# EAGLE design tetrafol (EAGLE 5.06)
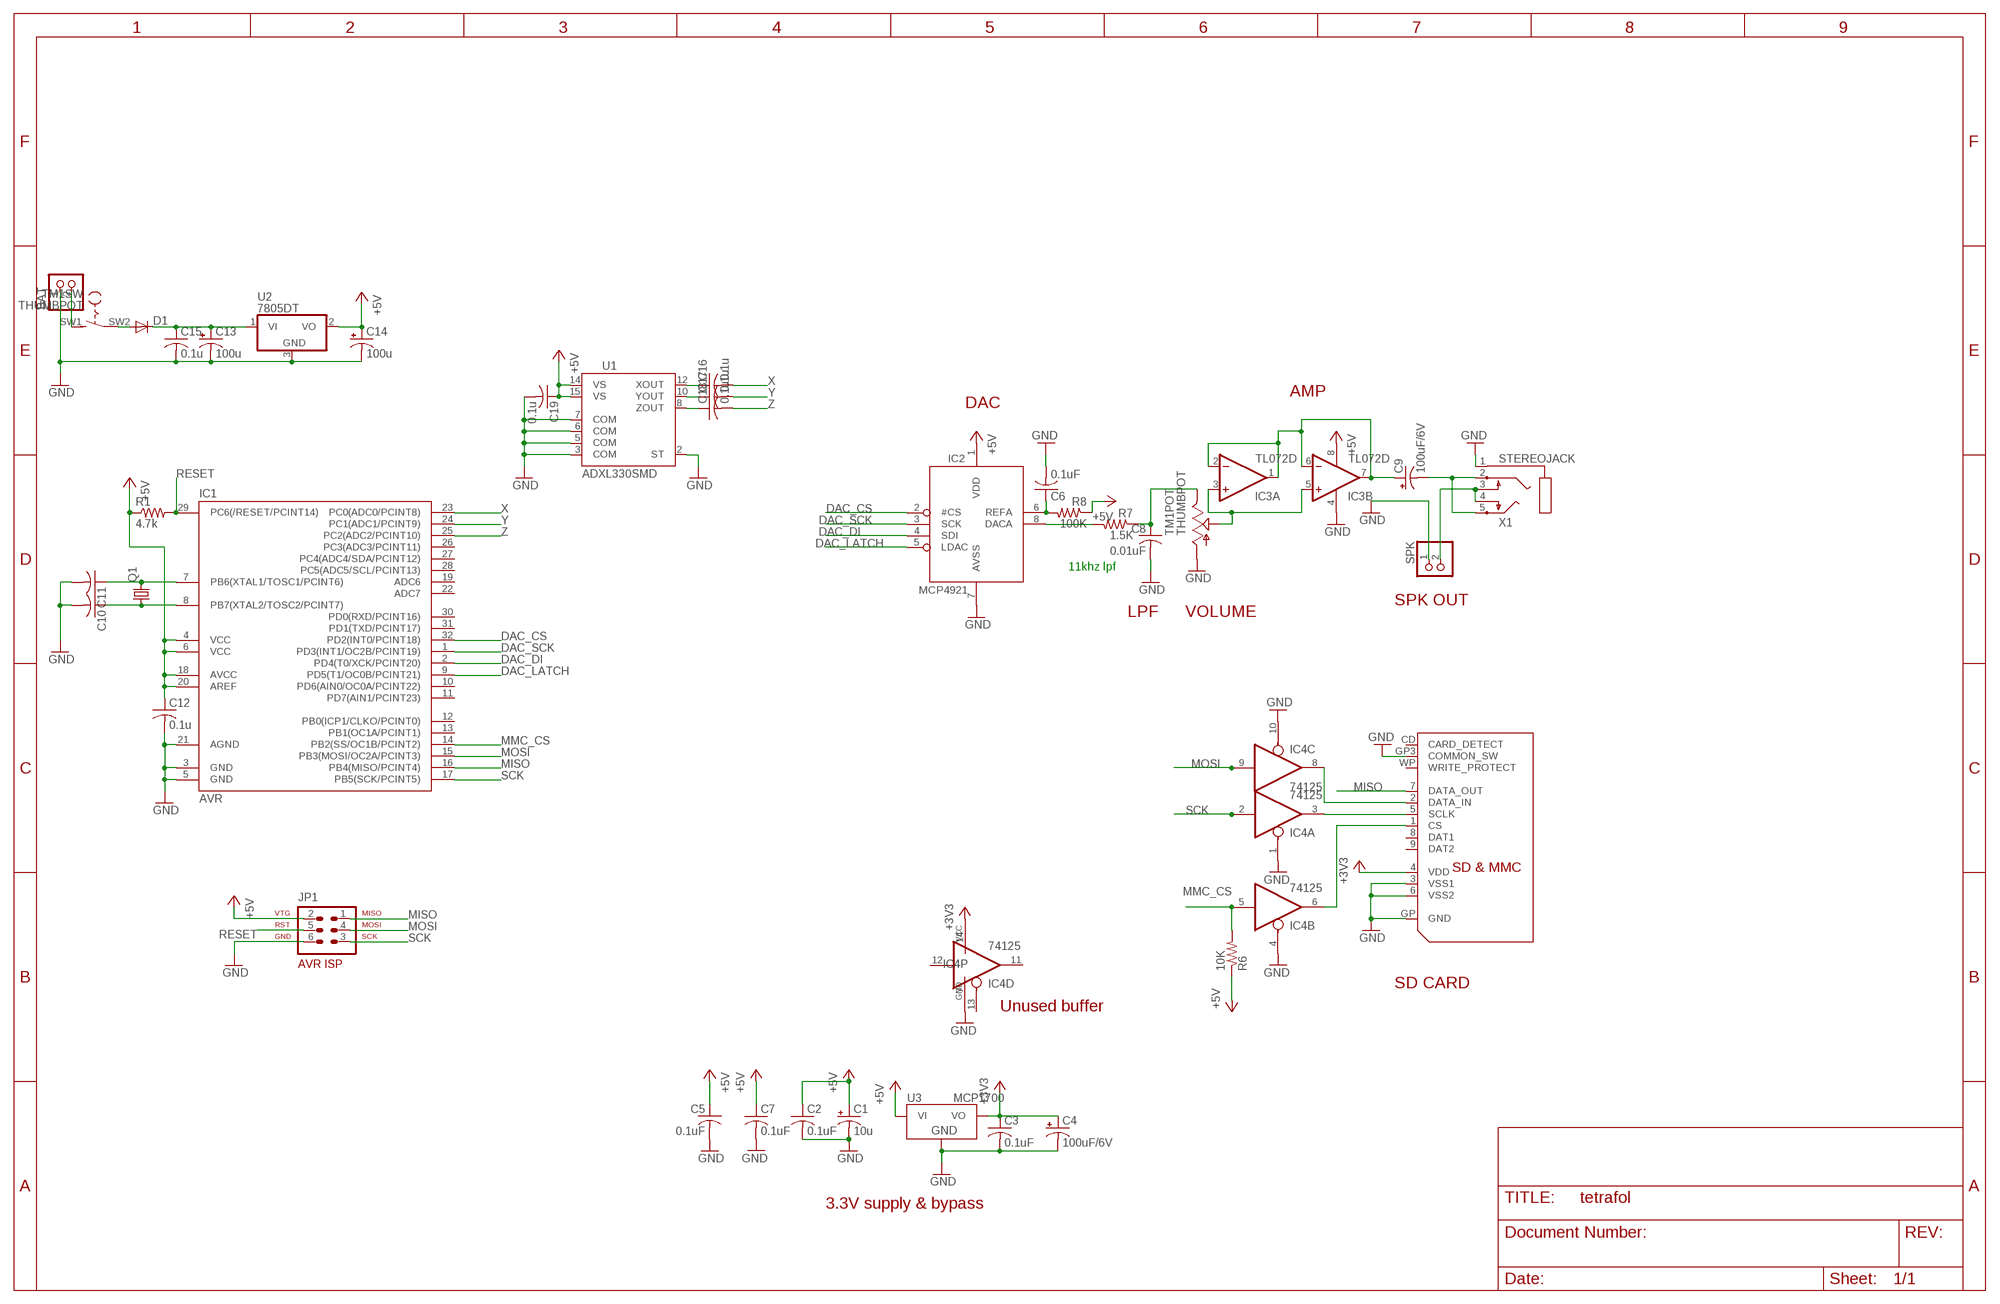
[diagram p0: schematic, sheet 1]

## Parts
BAT  PINHD-1X2  [1X02]
C1  10u  CPOL-USB  [PANASONIC_B]
C2  0.1uF  C-USC1206  [C1206]
C3  0.1uF  C-USC1206  [C1206]
C4  100uF/6V  CPOL-USC  [PANASONIC_C]
C5  0.1uF  C-USC1206  [C1206]
C6  0.1uF  C-USC1206  [C1206]
C7  0.1uF  C-USC1206  [C1206]
C8  0.01uF  C-USC1206  [C1206]
C9  100uF/6V  CPOL-USB  [PANASONIC_B]
C10  C-USC1206  [C1206]
C11  C-USC1206  [C1206]
C12  0.1u  C-USC1206  [C1206]
C13  100u  CPOL-USC  [PANASONIC_C]
C14  100u  CPOL-USC  [PANASONIC_C]
C15  0.1u  C-USC1206  [C1206]
C16  0.1u  C-USC1206  [C1206]
C17  0.1u  C-USC1206  [C1206]
C18  0.1u  C-USC1206  [C1206]
C19  0.1u  C-USC1206  [C1206]
D1  DIODESMA  [SMA-DIODE]
IC1  AVR  MEGA48/88/168-AU  [TQFP32-08]
IC2  MCP4921  [SO08]
IC3  TL072D  [SO08]
IC4  74125  [SO14]
JP1  isp  AVR-ISP-6  [AVR-ISP-6]
Q1  CRYSTALHC49UP  [HC49UP]
R1  4.7k  R-US_R1206  [R1206]
R6  10K  R-US_R1206  [R1206]
R7  1.5K  R-US_R1206  [R1206]
R8  100K  R-US_R1206  [R1206]
SPK  PINHD-1X2  [1X02]
TM1  THUMBPOT  [THUMBWHEEL]
U1  ADXL330SMD  [LFCSP-16]
U2  7805DT  [TO252]
U3  MCP1700  [SOT23]
U$2  SDMMC06132  [06132]
X1  STEREOJACK  [STX3100]

## Nets
+3V3: C3.1 C4.+ IC4.14(P:VCC) U3.2(VO) U$2.4(VDD)
+5V: C1.+ C2.1 C5.1 C7.1 C12.1 C14.+ C19.1 IC1.4(VCC) IC1.6(VCC) IC1.18(AVCC) IC1.20(AREF) IC2.1(VDD) IC3.8(P:V+) JP1.2 R1.1 R6.1 R8.1 U1.14(VS) U1.15(VS) U2.2(VO) U3.3(VI)
DAC_CS: IC1.32(PD2(INT0/PCINT18)) IC2.2(#CS)
DAC_DI: IC1.2(PD4(T0/XCK/PCINT20)) IC2.4(SDI)
DAC_LATCH: IC1.9(PD5(T1/OC0B/PCINT21)) IC2.5(LDAC)
DAC_SCK: IC1.1(PD3(INT1/OC2B/PCINT19)) IC2.3(SCK)
GND: BAT.1 C1.- C2.2 C3.2 C4.- C5.2 C6.2 C7.2 C8.2 C10.2 C11.2 C12.2 C13.- C14.- C15.2 C19.2 IC1.3(GND) IC1.5(GND) IC1.21(AGND) IC2.7(AVSS) IC3.4(P:V-) IC4.1(A:OE) IC4.4(B:OE) IC4.7(P:GND) IC4.10(C:OE) JP1.6 SPK.1 TM1.1(POT:A) U1.2(ST) U1.3(COM) U1.5(COM) U1.6(COM) U1.7(COM) U2.3(GND) U3.1(GND) U$2.3(VSS1) U$2.6(VSS2) U$2.GP3(COMMON_SW) U$2.GP(GND) X1.1
MISO: IC1.16(PB4(MISO/PCINT4)) JP1.1 U$2.7(DATA_OUT)
MMC_CS: IC1.14(PB2(SS/OC1B/PCINT2)) IC4.5(B:I) R6.2
MOSI: IC1.15(PB3(MOSI/OC2A/PCINT3)) IC4.9(C:I) JP1.4
N$1: IC3.3(A:+IN) IC3.5(B:+IN) TM1.2(POT:S)
N$2: C9.- X1.2 X1.5
N$3: C9.+ IC3.1(A:OUT) IC3.2(A:-IN) IC3.6(B:-IN) IC3.7(B:OUT)
N$4: IC2.8(DACA) R7.2
N$5: SPK.2 X1.3 X1.4
N$6: D1.A TM1.SW2(SW:P)
N$10: IC4.6(B:O) U$2.1(CS)
N$11: IC4.8(C:O) U$2.2(DATA_IN)
N$12: IC4.3(A:O) U$2.5(SCLK)
N$14: C16.1 U1.12(XOUT)
N$15: C17.1 U1.10(YOUT)
N$16: C18.1 U1.8(ZOUT)
N$19: C6.1 IC2.6(REFA) R8.2
N$21: C8.1 R7.1 TM1.3(POT:E)
N$23: C11.1 IC1.7(PB6(XTAL1/TOSC1/PCINT6)) Q1.2
N$24: C10.1 IC1.8(PB7(XTAL2/TOSC2/PCINT7)) Q1.1
N$26: C13.+ C15.1 D1.C U2.1(VI)
N$29: BAT.2 TM1.SW1(SW:S)
RESET: IC1.29(PC6(/RESET/PCINT14)) JP1.5 R1.2
SCK: IC1.17(PB5(SCK/PCINT5)) IC4.2(A:I) JP1.3
X: C16.2 IC1.23(PC0(ADC0/PCINT8))
Y: C17.2 IC1.24(PC1(ADC1/PCINT9))
Z: C18.2 IC1.25(PC2(ADC2/PCINT10))
Unconnected: IC1.10(PD6(AIN0/OC0A/PCINT22)) IC1.11(PD7(AIN1/PCINT23)) IC1.12(PB0(ICP1/CLKO/PCINT0)) IC1.13(PB1(OC1A/PCINT1)) IC1.19(ADC6) IC1.22(ADC7) IC1.26(PC3(ADC3/PCINT11)) IC1.27(PC4(ADC4/SDA/PCINT12)) IC1.28(PC5(ADC5/SCL/PCINT13)) IC1.30(PD0(RXD/PCINT16)) IC1.31(PD1(TXD/PCINT17)) IC4.11(D:O) IC4.12(D:I) IC4.13(D:OE) U$2.8(DAT1) U$2.9(DAT2) U$2.CD(CARD_DETECT) U$2.WP(WRITE_PROTECT)

## Notes on the sheet
- AMP
- DAC
- 11khz lpf
- SPK OUT
- LPF | VOLUME
- SD CARD
- Unused buffer
- 3.3V supply & bypass

## Library data of the parts
BAT SPK = pinhead:PINHD-1X2: PIN HEADER
C1 C4 C9 = adafruit:CPOL-US: POLARIZED CAPACITOR, American symbol
C2 C3 C5-C8 = adafruit:C-US: CAPACITOR, American symbol
C10-C12 C15-C19 = rcl:C-US: CAPACITOR, American symbol
C13 C14 = rcl:CPOL-US: POLARIZED CAPACITOR, American symbol
D1 = SparkFun:DIODE: Diode These are standard reverse protection diodes and small signal diodes. SMA package can handle up to about 1A. SOD-323 can handle about 200mA. What the SOD-323 package when ordering, there are some mfgs out there that are 5-pin packages.
IC1 = avr-5:MEGA48/88/168
IC2 = adafruit:MCP4921
IC3 = linear:TL072: OP AMP
IC4 = adafruit:74*125: Quad bus BUFFER, 3-state
JP1 = avr-5:AVR-ISP-6: AVR ISP-6 Serial Programming Header
Q1 = crystal:CRYSTAL: CRYSTAL
R1 = rcl:R-US_: RESISTOR, American symbol
R6-R8 = adafruit:R-US_: RESISTOR, American symbol
TM1 = adafruit:THUMBPOT: Thumbwheel pot with switch Available in horizontal (Alpha RV121SF) or vertical (Xicon 311-1701)
U1 = SparkFun:ADXL330: Triple Axis Accelerometer Analog Devices ADXL330 +/-3g 2.4V-5.25V Analog output. Spark Fun Electronics SKU : COM-00730. Center pad paste layer has been reduced to avoid shorting.
U2 = linear:78*: Positive VOLTAGE REGULATOR Source: http://cache.national.com/ds/LM/LM78L05.pdf http://www.fairchildsemi.com/ds/LM/LM7805.pdf
U3 = SparkFun:MCP1700
U$2 = adafruit:SDMMC: SD MMC Card holder 4UCON part #06132 - easy to solder
X1 = adafruit:STEREOJACK: MIC/HEADPHONE JACK Stereo jack with two switches. Kycon STX3100, CUI SJ1-3555NG and/or 4UCon 05544

## Board
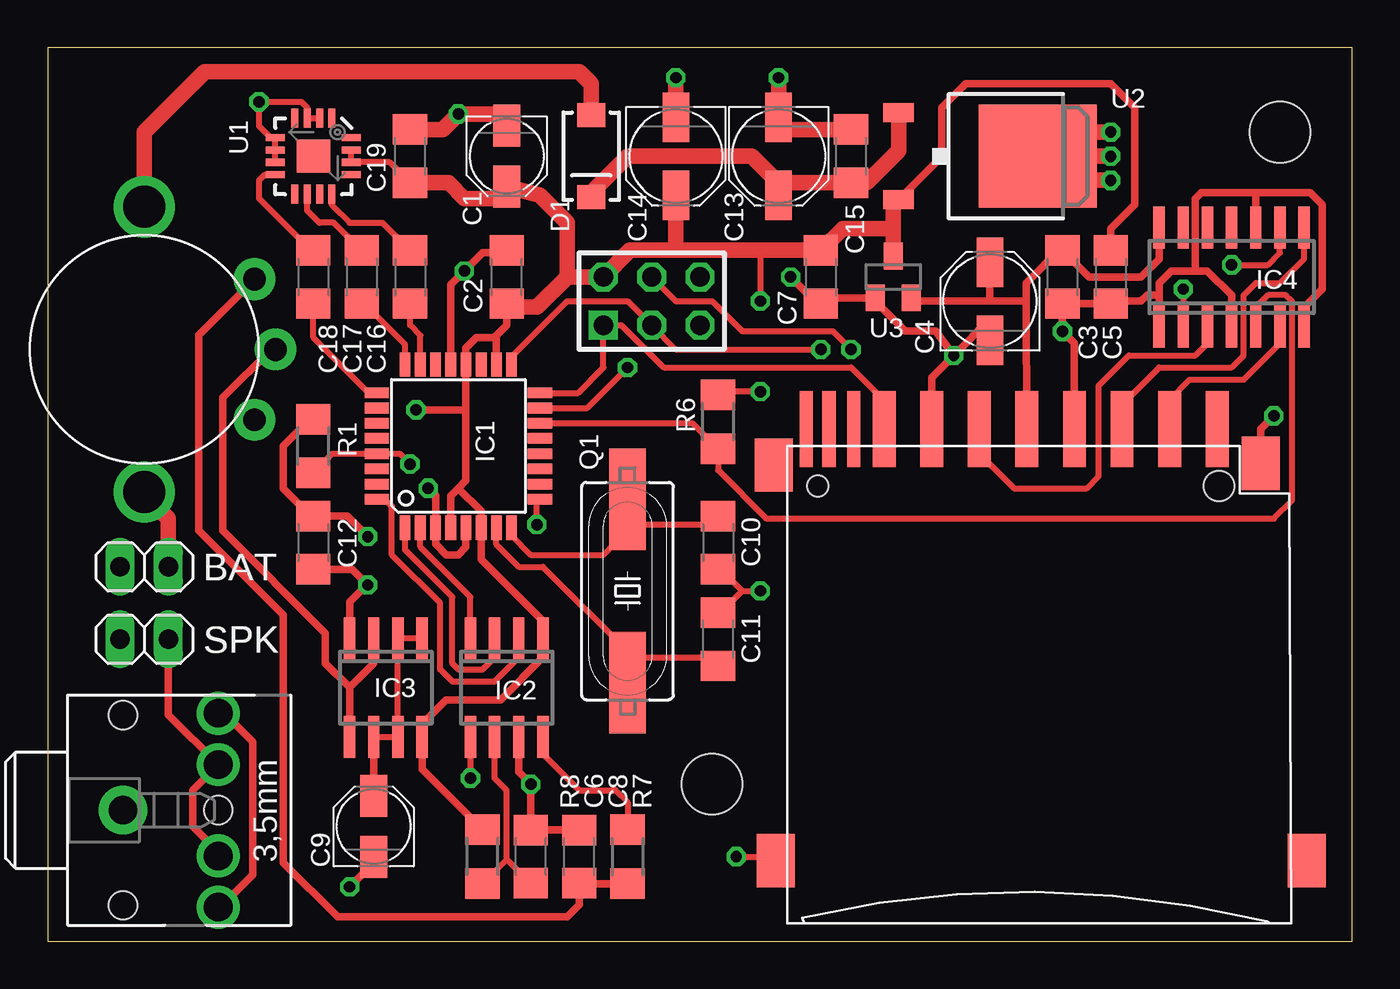
[diagram p1: board, top side]
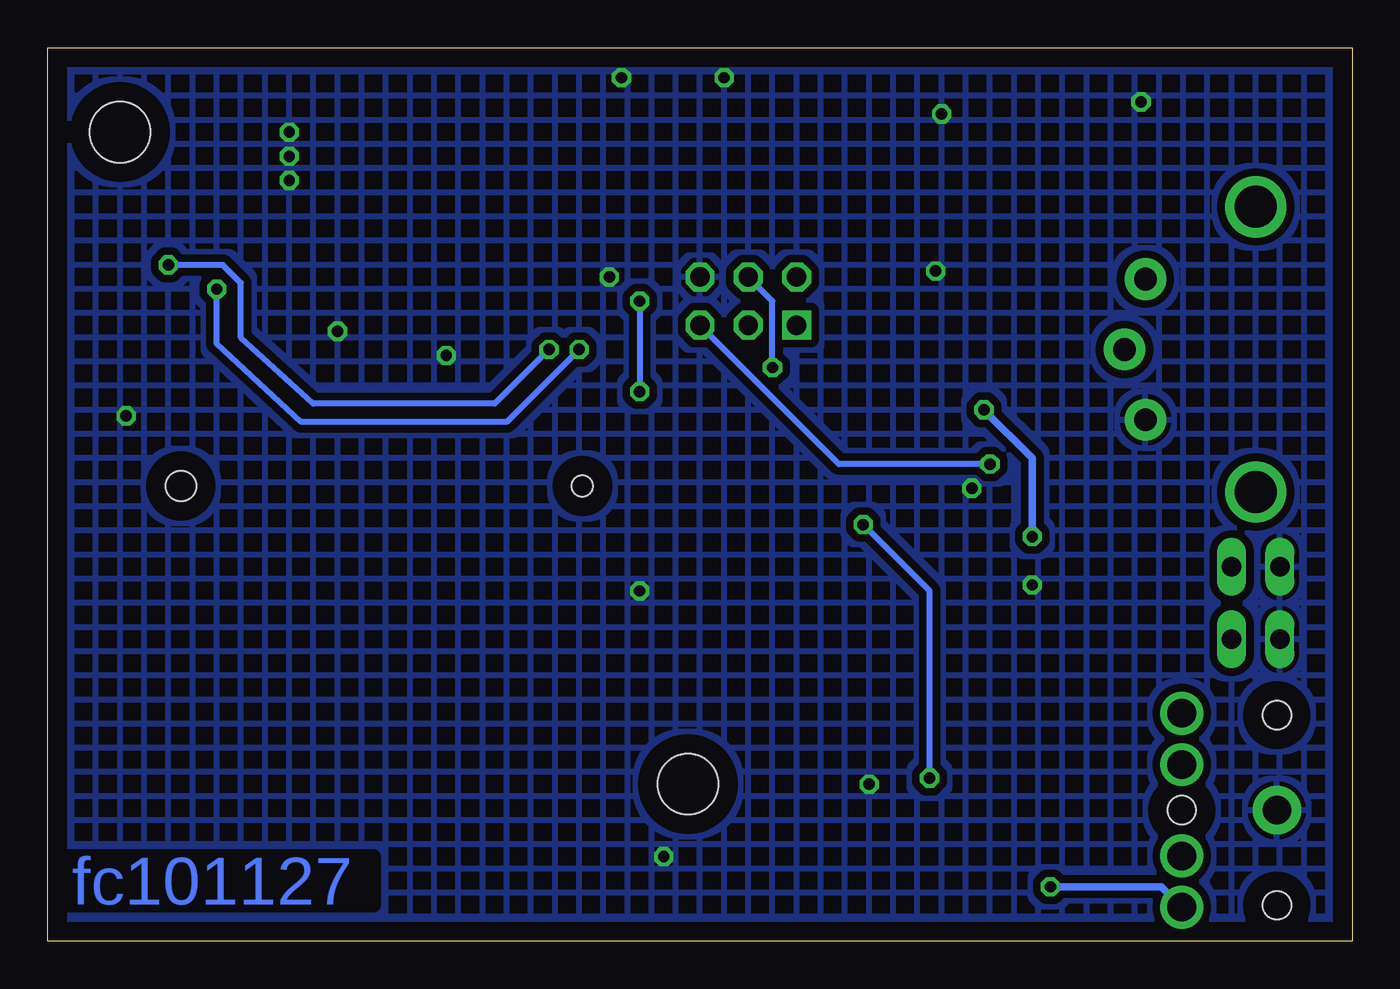
[diagram p2: board, bottom side, seen from below]

Size 68.58 x 46.99 mm. Coordinates in mm from the lower left corner, seen from the top.
Outline: 0,0 68.58,0 68.58,46.99 0,46.98 0,0
Copper layers (1*16): Top 0.035mm / dielectric 1.5mm / Bottom 0.035mm
Design rules "default": minimum track width 10mil, minimum drill 24mil, track to track 8mil, track to pad 8mil, pad to pad 8mil, via to via 8mil, smd to smd 8mil, copper to edge 40mil, drill to drill 8mil, minimum pad ring 10mil, minimum via ring 8mil, stop-mask expansion 4mil, vias tented up to drill 0mil, thermal gap 10mil
Holes 3.2 mm at 34.92,8.26 64.77,42.55

### Footprints (pad centres in the part's own frame; a part is rotated, then mirrored left to right if it is on the bottom)
1X02 = drill 1.016 long: 1 -1.27,0; 2 1.27,0
PANASONIC_B = smd 2.2 x 1.4: + 1.6,0; - -1.6,0
C1206 = smd 1.6 x 1.8: 1 -1.4,0; 2 1.4,0
PANASONIC_C = smd 2.6 x 1.4: + 2.05,0; - -2.05,0
SMA-DIODE = smd 1.27 x 1.47: A -2.15,0; C 2.15,0
TQFP32-08 = smd 1.27 x 0.559: 1 -4.293,2.8; 2 -4.293,2; 3 -4.293,1.2; 4 -4.293,0.4; 5 -4.293,-0.4; 6 -4.293,-1.2; 7 -4.293,-2; 8 -4.293,-2.8; 17 4.293,-2.8; 18 4.293,-2; 19 4.293,-1.2; 20 4.293,-0.4; 21 4.293,0.4; 22 4.293,1.2; 23 4.293,2; 24 4.293,2.8 | smd 0.559 x 1.27: 9 -2.8,-4.293; 10 -2,-4.293; 11 -1.2,-4.293; 12 -0.4,-4.293; 13 0.4,-4.293; 14 1.2,-4.293; 15 2,-4.293; 16 2.8,-4.293; 25 2.8,4.293; 26 2,4.293; 27 1.2,4.293; 28 0.4,4.293; 29 -0.4,4.293; 30 -1.2,4.293; 31 -2,4.293; 32 -2.8,4.293
SO08 = smd 0.6 x 2.2: 1 -1.905,-2.6; 2 -0.635,-2.6; 3 0.635,-2.6; 4 1.905,-2.6; 5 1.905,2.6; 6 0.635,2.6; 7 -0.635,2.6; 8 -1.905,2.6
SO14 = smd 0.6 x 2.2: 1 -3.81,-2.6; 2 -2.54,-2.6; 3 -1.27,-2.6; 4 0,-2.6; 5 1.27,-2.6; 6 2.54,-2.6; 7 3.81,-2.6; 8 3.81,2.6; 9 2.54,2.6; 10 1.27,2.6; 11 0,2.6; 12 -1.27,2.6; 13 -2.54,2.6; 14 -3.81,2.6
AVR-ISP-6 = drill 1.016 square: 1 -2.54,-1.27 | drill 1.016 octagon: 2 -2.54,1.27; 3 0,-1.27; 4 0,1.27; 5 2.54,-1.27; 6 2.54,1.27
HC49UP = smd 5.334 x 1.93: 1 -4.826,0; 2 4.826,0
R1206 = smd 1.6 x 1.8: 1 -1.4,0; 2 1.4,0
R1206' = smd 1.6 x 1.803: 1 -1.422,0; 2 1.422,0
THUMBWHEEL = drill 1.2 pad 2.184 round: 1 -3.7,-5.8; 2 0,-6.9; 3 3.7,-5.8 | drill 2.2 round: SW1 -7.5,0; SW2 7.5,0
LFCSP-16 = smd 1.75 x 1.75: 0 0,0 | smd 1 x 0.37: 1 -2,0.975; 2 -2,0.325; 3 -2,-0.325; 4 -2,-0.975; 9 2,-0.975; 10 2,-0.325; 11 2,0.325; 12 2,0.975 | smd 0.37 x 1: 5 -0.975,-2; 6 -0.325,-2; 7 0.325,-2; 8 0.975,-2; 13 0.975,2; 14 0.325,2; 15 -0.325,2; 16 -0.975,2
TO252 = smd 1 x 1.6: 1 -2.28,-4.8; 2 2.28,-4.8 | smd 5.4 x 6.2: 3 0,2.5
SOT23 = smd 1 x 1.4: 1 -0.95,-1.1; 2 0.95,-1.1; 3 0,1.1
06132 = smd 1.2 x 4: 1 6.9,0.9; 2 4.4,0.9; 3 1.9,0.9; 4 -0.6,0.9; 5 -3.1,0.9; 6 -5.6,0.9; 7 -8.1,0.9; 9 9.4,0.9 | smd 0.7 x 4: 8 -9.7,0.9; CD -11,0.9; WP -12.2,0.9 | smd 2 x 2.8: GP -13.8,-21.8; GP2 14.1,-21.8; GP3 11.7,-0.9; GP4 -13.9,-1 | hole 1.1: -11.6,-2.1 | hole 1.6: 9.5,-2.1
STX3100 = drill 1.5 pad 2.54 round: 1 2.7,-0.1 | drill 1.5 round: 2 7.7,5; 3 7.7,2.3; 4 7.7,-2.5; 5 7.7,-5.2 | hole 1.5: 2.7,4.9; 2.7,-5.1; 7.7,-0.1

### Placement (x,y rotation side)
BAT  5.08,19.68 0 top
C1  24.13,41.27 270 top
C2  24.13,34.92 90 top
C3  53.34,34.92 270 top
C4  49.53,33.66 90 top
C5  55.88,34.92 270 top
C6  25.4,4.45 90 top
C7  40.64,34.92 270 top
C8  27.94,4.45 90 top
C9  17.14,6.03 90 top
C10  35.24,20.95 270 top
C11  35.24,15.88 90 top
C12  13.97,20.95 270 top
C13  38.42,41.27 270 top
C14  33.02,41.27 270 top
C15  42.23,41.27 90 top
C16  19.05,34.92 270 top
C17  16.51,34.92 270 top
C18  13.97,34.92 270 top
C19  19.05,41.27 90 top
D1  28.57,41.27 270 top
IC1  21.59,26.04 90 top
IC2  24.13,13.34 180 top
IC3  17.78,13.34 180 top
IC4  62.23,34.92 0 top
JP1  31.75,33.66 0 top
Q1  30.48,18.41 270 top
R1  13.97,26.04 270 top
R6  10K  [R1206']  35.24,27.3 270 top
R7  1.5K  [R1206']  30.48,4.45 90 top
R8  100K  [R1206']  22.86,4.45 270 top
SPK  5.08,15.88 0 top
TM1  5.08,31.11 90 top
U1  13.97,41.27 270 top
U2  49.53,41.27 270 top
U3  44.45,34.92 0 top
U$2  52.07,26.04 0 top
X1  1.27,6.99 0 top

### Tracks (layer width: path | path; a pad name or v marks a point on that pad's centre or on a via)
+3V3
  Top 0.406: IC4.14 58.42,35.88 57.47,34.92 54.74,34.92 C3.1 | C4.+ 49.73,36.33 49.73,35.99 49.53,35.88 C4.+ | U3.2 45.4,33.97 45.72,33.66 49.53,33.66 | 49.53,33.66 C4.+ | U$2.4 51.44,33.66 | 51.44,33.66 49.53,33.66 | C3.1 53.34,36.51 51.44,34.61 51.44,33.66 | C3.1 53.34,36.2
+5V  (via drill 0.6)
  Top 0.305: U1.15 U1.14 17.98,40.95 C19.1 | 37.47,36.33 v37.47,33.66 | v37.47,28.89 35.41,28.89 R6.1
  Top 0.406: 23.59,31.84 IC1.18 | 23.59,31.84 24.13,32.38 C2.1 | 23.59,31.84 23.37,31.75 22.54,31.75 21.99,31.2 IC1.20 21.99,27.94 | 21.59,23.81 22.79,22.61 IC1.6 22.79,20.07 26.04,16.83 IC2.1 26.04,14.92 23.81,12.7 20.95,12.7 19.68,11.43 IC3.8 19.68,9.04 R8.1 | 21.99,27.94 21.99,24.21 21.59,23.81 | IC1.4 21.19,23.41 21.59,23.81 | v16.83,21.27 15.74,22.36 C12.1 13.46,22.86 13.34,22.86 12.38,23.81 12.38,26.04 13.78,27.43 R1.1 | 21.99,27.94 v19.37,27.94 | C5.1 55.88,37.47 57.15,38.73 57.15,43.81 55.88,45.09 48.26,45.09 46.99,43.81 46.99,41.26 U2.2
  Top 0.813: 44.45,37.47 41.78,37.47 C7.1 37.47,36.33 33.02,36.33 | 44.45,37.47 U3.3 | 33.02,36.33 30.61,36.33 JP1.2 27.3,34.92 | 33.02,36.33 C14.+ | 27.3,34.92 25.72,33.34 24.32,33.34 C2.1 | 27.3,34.92 27.3,37.78 25.86,39.23 C1.+ 23.96,39.05 21.91,39.05 21.09,39.88 C19.1 | U2.2 44.71,38.99 44.45,38.73 44.45,37.47
  Bottom 0.305: v37.47,33.66 v37.47,28.89
  Bottom 0.406: v16.83,21.27 16.83,25.4 v19.37,27.94
DAC_CS
  Top 0.305: IC2.2 24.77,14.92 23.5,13.65 21.27,13.65 20.64,14.29 20.64,17.78 18.1,20.32 18.1,22.86 17.72,23.23 IC1.32
DAC_DI
  Top 0.305: IC1.2 19.59,20.73 22.23,18.1 IC2.4
DAC_LATCH  (via drill 0.6)
  Top 0.305: IC2.5 v22.23,8.57 | 25.72,23.23 IC1.9 | 25.72,23.23 25.66,23.23 | v25.72,21.91 25.72,23.23
  Bottom 0.305: v22.23,8.57 22.23,18.41 v25.72,21.91
DAC_SCK
  Top 0.305: IC2.3 23.5,14.92 22.86,14.29 21.59,14.29 21.27,14.61 21.27,18.1 18.79,20.58 IC1.1
GND  (via drill 0.6)
  Top 0.305: U1.2 U1.3 13.64,43.82 13.34,44.13 v11.11,44.13 11.11,42.86 11.72,42.25 U1.5 U1.6 U1.7 | U$2.GP 38.27,4.28 38.1,4.45 v36.2,4.45 | C11.2 35.37,17.27 36.51,18.41 | 36.51,18.41 v37.47,18.41 | C10.2 35.37,19.55 36.51,18.41
  Top 0.406: IC1.5 21.99,20.72 21.59,20.32 20.95,20.32 20.39,20.89 IC1.3 20.39,23.43 v20,23.81 | 15.88,15.24 IC3.4 15.88,17.84 16.64,18.6 v16.83,18.73 16,19.55 C12.2 | U$2.6 46.47,29.64 v47.62,30.8 | v47.62,30.8 49.53,32.7 C4.- | U$2.3 53.97,31.44 v53.34,32.07 C3.2 C5.2 56.01,33.66 57.47,33.66 57.78,33.97 58.42,33.97 | v47.62,30.8 46.67,32.07 45.09,32.07 43.5,33.65 U3.1 40.94,33.83 C7.2 40.45,33.52 v39.05,34.92 | 58.42,33.02 IC4.1 58.42,33.97 | C8.2 C6.2 v25.4,8.26 24.77,8.89 IC2.7 | IC1.21 21.19,34.52 v21.91,35.24 22.86,36.2 24,36.2 C2.2 | 58.42,33.97 58.42,34.61 59.05,35.24 60.33,35.24 | 60.33,35.24 60.96,35.24 62.23,33.97 IC4.4 | 63.5,39.37 IC4.10 | 63.5,39.37 60.64,39.37 60.33,39.05 60.33,35.24 | IC4.7 66.04,33.34 66.99,34.29 66.99,38.73 66.36,39.37 63.5,39.37 | U$2.GP3 63.77,26.94 v64.45,27.62
  Top 0.813: C19.2 20.77,42.67 v21.59,43.5 23.96,43.5 C1.- | C14.- v33.02,45.4 | v38.42,45.4 C13.- 38.42,42.86 38.6,42.67 C15.2 | U2.3 53.34,41.27 54.61,40.01 | 54.61,40.01 v55.88,40.01 | 54.61,40.01 54.61,41.27 | 54.61,41.27 v55.88,41.27 | 54.61,41.27 54.61,42.55 v55.88,42.55
  pour Bottom (isolate 0.406, hatched): 0,0 68.58,0 68.58,46.99 0,46.99
MISO
  Top 0.305: IC1.16 27.88,28.84 29.21,30.16 JP1.1 30.16,32.38 32.38,30.16 42.23,30.16 43.97,28.42 U$2.7
MMC_CS
  Top 0.305: IC4.5 63.5,33.34 64.14,33.97 65.09,33.97 65.41,33.66 65.41,23.18 64.45,22.23 37.78,22.23 35.24,24.77 R6.2 33.89,27.23 IC1.14
MOSI  (via drill 0.6)
  Top 0.305: IC1.15 28.35,28.04 v30.48,30.16 | JP1.4 33.02,33.66 34.92,33.66 36.51,32.07 41.27,32.07 v42.23,31.11 | v62.23,35.56 64.14,35.56 64.77,36.2 IC4.9
  Bottom 0.305: v30.48,30.16 30.48,33.66 JP1.4 | v42.23,31.11 45.09,28.26 54.61,28.26 58.42,31.75 58.42,34.61 59.37,35.56 v62.23,35.56
N$1
  Top 0.406: 17.14,16.83 IC3.3 17.14,14.61 15.88,13.34 | IC3.5 15.88,13.34 | 15.88,13.34 14.61,14.61 14.61,16.19 9.21,21.59 9.21,28.57 11.75,31.11 TM1.2
N$2  (via drill 0.6)
  Top 0.406: X1.2 9.29,11.98 10.79,10.48 10.79,3.49 9.09,1.78 X1.5 | C9.- 17.14,4.13 v15.88,2.86
  Bottom 0.406: v15.88,2.86 10.04,2.86 X1.5
N$3
  Top 0.305: IC3.1 IC3.2 IC3.7 IC3.6
  Top 0.406: C9.+ IC3.6
N$4
  Top 0.305: IC2.8 26.04,9.84 27.94,7.94 29.84,7.94 30.48,7.3 R7.2
N$5
  Top 0.406: SPK.2 6.35,11.9 X1.3 7.62,7.93 7.62,6.03 8.97,4.68 X1.4
N$6
  Top 0.813: TM1.SW2 5.08,42.55 8.26,45.72 27.94,45.72 28.57,45.09 D1.A
N$10
  Top 0.305: U$2.1 58.97,28.49 60.01,29.53 62.87,29.53 64.77,31.43 IC4.6
N$11
  Top 0.305: U$2.2 56.47,28.21 58.42,30.16 62.23,30.16 62.87,30.8 62.87,33.97 63.5,34.61 64.77,34.61 66.04,35.88 IC4.8
N$12
  Top 0.305: IC4.3 60.96,31.43 60.33,30.8 56.83,30.8 55.24,29.21 55.24,24.45 54.61,23.81 50.8,23.81 48.9,25.72 48.9,27.01 | 48.9,27.01 48.9,28.26 | 48.9,27.01 U$2.5
N$14
  Top 0.305: U1.12 14.95,38.71 15.88,37.78 17.59,37.78 C16.1
N$15
  Top 0.305: U1.10 13.64,38.42 14.29,37.78 15.05,37.78 C17.1
N$16
  Top 0.305: U1.8 11.41,40.3 11.11,40.01 11.11,39.05 13.34,36.83 13.46,36.83 C18.1
N$19
  Top 0.305: IC2.6 23.5,8.57 24.13,7.94 24.13,4.32 | 24.13,4.32 C6.1 | 24.13,4.32 24.13,4.29 R8.2
N$21
  Top 0.406: R7.1 27.96,3.02 C8.1 27.94,1.91 27.3,1.27 15.24,1.27 12.38,4.13 12.38,17.14 7.94,21.59 7.94,31.87 TM1.3
N$23
  Top 0.305: IC1.7 23.59,20.86 24.77,19.68 26.04,19.68 30.48,15.24 30.48,14.92 | 30.48,14.92 Q1.2 | 30.48,14.92 30.8,14.61 30.8,14.92 34.8,14.92 C11.1
N$24
  Top 0.305: IC1.8 24.39,21.33 25.4,20.32 29.21,20.32 29.84,20.95 29.84,21.27 30.48,21.91 | 30.48,21.91 Q1.1 | 30.48,21.91 34.8,21.91 C10.1
N$26
  Top 0.813: D1.C 28.57,39.37 30.48,41.27 37,41.27 38.5,39.77 | 38.5,39.77 C13.+ | 38.5,39.77 38.6,39.88 C15.1 43.05,39.88 44.73,41.55 U2.1
N$29
  Top 0.813: TM1.SW1 5.08,23.5 6.35,22.23 BAT.2
RESET  (via drill 0.6)
  Top 0.305: R1.2 14.97,25.64 IC1.29 18.5,25.64 v19.05,25.08
  Bottom 0.305: v19.05,25.08 26.99,25.08 JP1.5
SCK  (via drill 0.6)
  Top 0.305: IC1.17 24.39,30.74 27.3,33.66 30.48,33.66 JP1.3 33.02,31.11 v40.64,31.11 | v59.69,34.29 IC4.2
  Bottom 0.305: v59.69,34.29 59.69,31.43 55.24,27.3 44.45,27.3 v40.64,31.11
X
  Top 0.305: C16.2 19.05,32.38 19.59,31.84 IC1.23
Y
  Top 0.305: C17.2 16.64,33.52 18.79,31.38 IC1.24
Z
  Top 0.305: IC1.25 16.89,28.84 13.97,31.75 C18.2

### Text on the board
Bottom: fc101127
_tNames: U2 | U1 | C19 | C1 | D1 | C14 | C13 | C15 | IC4 | C2 | C7 | U3 | C3 | C5 | C4 | C18 | C17 | C16 | R6 | R1 | IC1 | Q1 | C12 | C10 | BAT | SPK | C11 | IC3 | IC2 | R8 | C6 | C8 | R7 | C9